# Altium schematic sheet esquematico.SchDoc: Vúmetro
size A2; Date: 27/9; DrawnBy: grupo 11; Organization: Colegio Pio IX; Address1: Yapeyú 197; Address2: Almagro; Address3: CABA; Address4: Argentina; Revision: 1.0; SheetNumber: 1; SheetTotal: 1
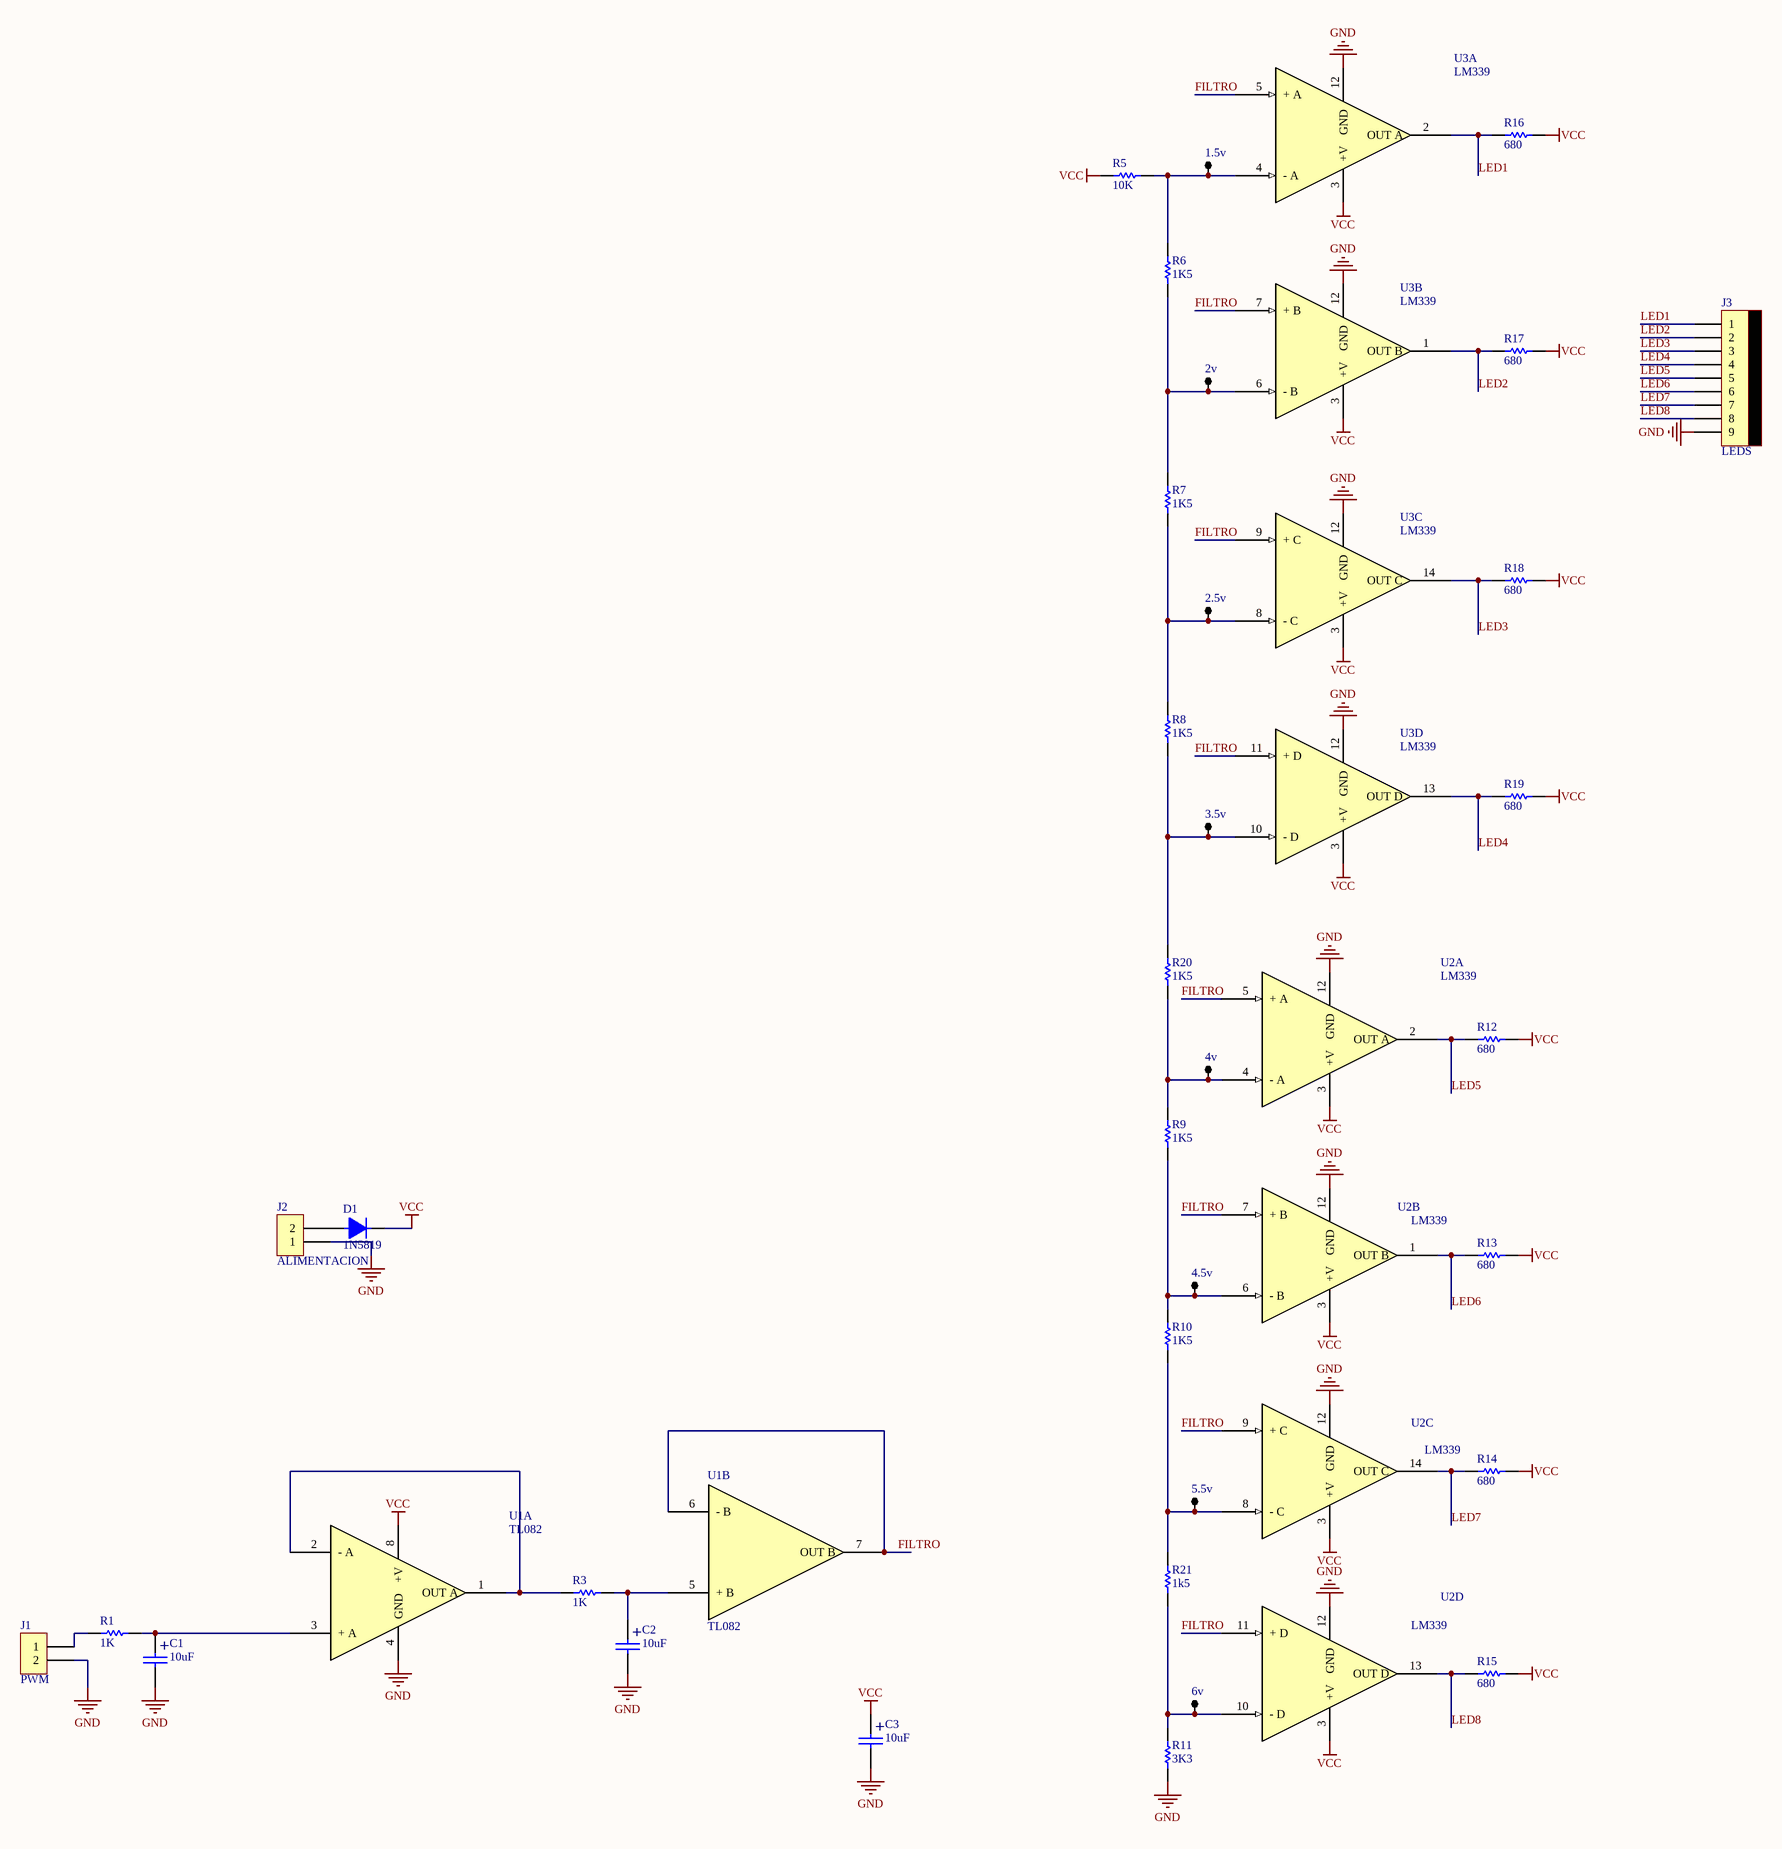
[diagram p0: esquematico.SchDoc]

## Parts
1.5v  (no value)  [TPTH]
2.5v  (no value)  [TPTH]
2v  (no value)  [TPTH]
3.5v  (no value)  [TPTH]
4.5v  (no value)  [TPTH]
4v  (no value)  [TPTH]
5.5v  (no value)  [TPTH]
6v  (no value)  [TPTH]
C1  10uF  [CAP100RP]
C2  10uF  [CAP100RP]
C3  10uF  [CAP100RP]
D1  1N5819  [DO41]
J1  PWM  [BORNERA2]
J2  ALIMENTACION  [BORNERA2]
J3  LEDS  [MOLEX9]
R1  1K  [RES400]
R3  1K  [RES400]
R5  10K  [RES400]
R6  1K5  [RES400]
R7  1K5  [RES400]
R8  1K5  [RES400]
R9  1K5  [RES400]
R10  1K5  [RES400]
R11  3K3  [RES400]
R12  680  [RES400]
R13  680  [RES400]
R14  680  [RES400]
R15  680  [RES400]
R16  680  [RES400]
R17  680  [RES400]
R18  680  [RES400]
R19  680  [RES400]
R20  1K5  [RES400]
R21  1k5  [RES400]
U1  TL082  [DIP8]  (parts A,B of 2)
U2  LM339  [DIP14]  (parts A,B,C,D of 4)
U3  LM339  [DIP14]  (parts A,B,C,D of 4)

## Nets
GND: C1.2 C2.2 C3.2 J1.2 J2.1 J3.9 R11.1 U1.4(GND) U2.12(GND) U3.12(GND)
VCC: C3.1 D1.2 R5.1 R12.2 R13.2 R14.2 R15.2 R16.2 R17.2 R18.2 R19.2 U1.8(+V) U2.3(+V) U3.3(+V)
FILTRO: U1.6(-_B) U1.7(OUT_B) U2.5(+_A) U2.7(+_B) U2.9(+_C) U2.11(+_D) U3.5(+_A) U3.7(+_B) U3.9(+_C) U3.11(+_D)
LED1: J3.1 R16.1 U3.2(OUT_A)
LED2: J3.2 R17.1 U3.1(OUT_B)
LED3: J3.3 R18.1 U3.14(OUT_C)
LED4: J3.4 R19.1 U3.13(OUT_D)
LED5: J3.5 R12.1 U2.2(OUT_A)
LED6: J3.6 R13.1 U2.1(OUT_B)
LED7: J3.7 R14.1 U2.14(OUT_C)
LED8: J3.8 R15.1 U2.13(OUT_D)
Net1.5v_1: 1.5v.1 R5.2 R6.2 U3.4(-_A)
Net2.5v_1: 2.5v.1 R7.1 R8.2 U3.8(-_C)
Net2v_1: 2v.1 R6.1 R7.2 U3.6(-_B)
Net3.5v_1: 3.5v.1 R8.1 R20.2 U3.10(-_D)
Net4.5v_1: 4.5v.1 R9.1 R10.2 U2.6(-_B)
Net4v_1: 4v.1 R9.2 R20.1 U2.4(-_A)
Net5.5v_1: 5.5v.1 R10.1 R21.2 U2.8(-_C)
Net6v_1: 6v.1 R11.2 R21.1 U2.10(-_D)
NetC1_1: C1.1 R1.2 U1.3(+_A)
NetC2_1: C2.1 R3.2 U1.5(+_B)
NetD1_1: D1.1 J2.2
NetJ1_1: J1.1 R1.1
NetR3_1: R3.1 U1.1(OUT_A) U1.2(-_A)

## Notes on the sheet
- Title
- Size:
- Date:
- File:
- A2
- Number:
- Time:
- Revision:
- Sheet
- of
- (in symbol CAPPOL) +

## Library data of the parts
1.5v 2.5v 2v 3.5v 4.5v 4v 5.5v 6v = TP
C1-C3 = CAPPOL
D1 = DIODO
J1 J2 = BORNERA 2
J3 = MOLEX9
R1 R3 R5-R21 = RES
U2 U3 = LM339: Comparador Open Collector